# Altium schematic sheet simplefocmini_2024-04-26.schdoc
size 193 x 117 mm
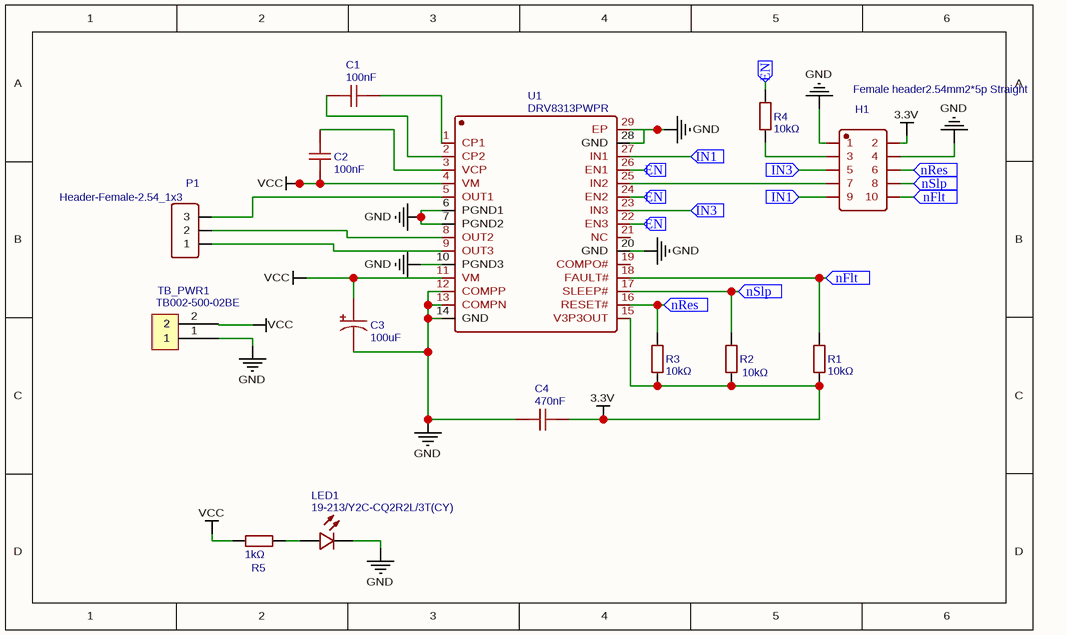
[diagram p0: simplefocmini_2024-04-26.schdoc]

## Parts
C1  100nF  [C0603]
C2  100nF  [C0603]
C3  100uF  [CAP-SMD_BD6.3-L6.6-W6.6-FD]
C4  470nF  [C0603]
H1  Female header2.54mm2*5p Straight  [HDR-TH_10P-P2.54-V-F-R2-C5-S2.54]
LED1  19-213/Y2C-CQ2R2L/3T(CY)  [LED0603-R-RD]
P1  Header-Female-2.54_1x3  [HDR-TH_3P-P2.54-V-F]
R1  10kΩ  [R0603]
R2  10kΩ  [R0603]
R3  10kΩ  [R0603]
R4  10kΩ  [R0603]
R5  1kΩ  [R0603]
TB_PWR1  TB002-500-02BE  [TB002-500-02BE]
U1  DRV8313PWPR  [HTSSOP-28_L9.8-W4.5-P0.65-LS6.6-BL-EP]

## Ports
EN (in), IN1 (in), IN3 (in), nFlt (in), nRes (in), nSlp (in)

## Nets
3.3V: C4.2 H1.2 R1.1 R2.1 R3.1 U1.15(V3P3OUT)
GND: C3.2 C4.1 H1.1 H1.4 LED1.2(C) TB_PWR1.1 U1.6(PGND1) U1.7(PGND2) U1.10(PGND3) U1.12(COMPP) U1.13(COMPN) U1.14(GND) U1.20(GND) U1.28(GND) U1.29(EP)
VCC: C2.1 C3.1 R5.1 TB_PWR1.2 U1.4(VM) U1.11(VM)
EN: R4.2 U1.22(EN3) U1.24(EN2) U1.26(EN1) ; port EN
IN1: H1.9 U1.27(IN1) ; port IN1
IN3: H1.5 U1.23(IN3) ; port IN3
nFlt: H1.10 R1.2 U1.18(FAULT#) ; port nFlt
nRes: H1.6 R3.2 U1.16(RESET#) ; port nRes
nSlp: H1.8 R2.2 U1.17(SLEEP#) ; port nSlp
NetC1_1: C1.1 U1.2(CP2)
NetC1_2: C1.2 U1.1(CP1)
NetC2_2: C2.2 U1.3(VCP)
NetH1_3: H1.3 R4.1
NetH1_7: H1.7 U1.25(IN2)
NetLED1_1: LED1.1(A) R5.2
NetP1_1: P1.1 U1.9(OUT3)
NetP1_2: P1.2 U1.8(OUT2)
NetP1_3: P1.3 U1.5(OUT1)

Not connected (* = marked no-connect by the designer): U1 19(COMPO#) 21(NC)

## Library data of the parts
C1 C2 = 100nF: Manufacturer: SAMSUNG; Manufacturer Part: CL10B104KB8NNNC; nameAlias: Capacitance; Supplier: LCSC; Supplier Part: C1591; spicePre: C; spiceSymbolName: CL10B104KB8NNNC
C3 = 100uF: Manufacturer: Vertical Technology; Manufacturer Part: VT1V101M-CRE77; nameAlias: Capacitance; Contributor: LCSC; Supplier: LCSC; Supplier Part: C294520; spicePre: C; spiceSymbolName: VT1V101M-CRE77
C4 = 470nF: Manufacturer: YAGEO; Manufacturer Part: CC0603ZRY5V6BB474; nameAlias: Capacitance; Contributor: LCSC; Supplier: LCSC; Supplier Part: C327269; spicePre: C; spiceSymbolName: CC0603ZRY5V6BB474
H1 = Female header2.54mm2*5p Straight: Manufacturer: ReliaPro; Supplier Part: C30419; Supplier: LCSC; Manufacturer Part: Female header2.54mm2*5p Straight; JLCPCB Part Class: Extended Part; spicePre: H; spiceSymbolName: Female header2.54mm2*5p Straight
LED1 = 19-213/Y2C-CQ2R2L/3T(CY): Manufacturer: EVERLIGHT; Supplier: LCSC; Manufacturer Part: 19-213/Y2C-CQ2R2L/3T(CY); Supplier Part: C72038; JLCPCB Part Class: Basic Part; spicePre: L; spiceSymbolName: 19-213/Y2C-CQ2R2L/3T(CY)
P1 = Header-Female-2.54_1x3: Manufacturer: Boom Precision Elec; Supplier Part: C146243; Supplier: LCSC; Manufacturer Part: Header-Female-2.54_1x3; link: https://datasheet.lcsc.com/szlcsc/Boom-Precision-Elec-2-54mm-1-8P-Straight-Female-header_C27438.pdf; JLCPCB Part Class: Extended Part; spicePre: P; spiceSymbolName: Header-Female-2.54_1x3
R1-R4 = 10kΩ: Manufacturer: UniOhm; Manufacturer Part: 0603WAF4701T5E; nameAlias: Resistance; Resistance (Ohms): 4.7K; Supplier: LCSC; Supplier Part: C23162; JLCPCB Part Class: Basic Part; spicePre: R; spiceSymbolName: 0603WAF4701T5E
R5 = 1kΩ: Manufacturer: UniOhm; Manufacturer Part: 0603WAF4701T5E; nameAlias: Resistance; Resistance (Ohms): 4.7K; Supplier: LCSC; Supplier Part: C23162; JLCPCB Part Class: Basic Part; spicePre: R; spiceSymbolName: 0603WAF4701T5E
TB_PWR1 = TB002-500-02BE: Contributor: the.skuric; Supplier 1: Mouser; Supplier Part Number 1: 490-TB002-500-02BE; spicePre: T; spiceSymbolName: TB002-500-02BE
U1 = DRV8313PWPR: Manufacturer: Texas Instruments; Contributor: LCSC; Supplier: LCSC; Supplier Part: C92482; Manufacturer Part: DRV8313PWPR; JLCPCB Part Class: Extended Part; spicePre: U; spiceSymbolName: DRV8313PWPR